# Altium project Line follower 3.PrjPcb
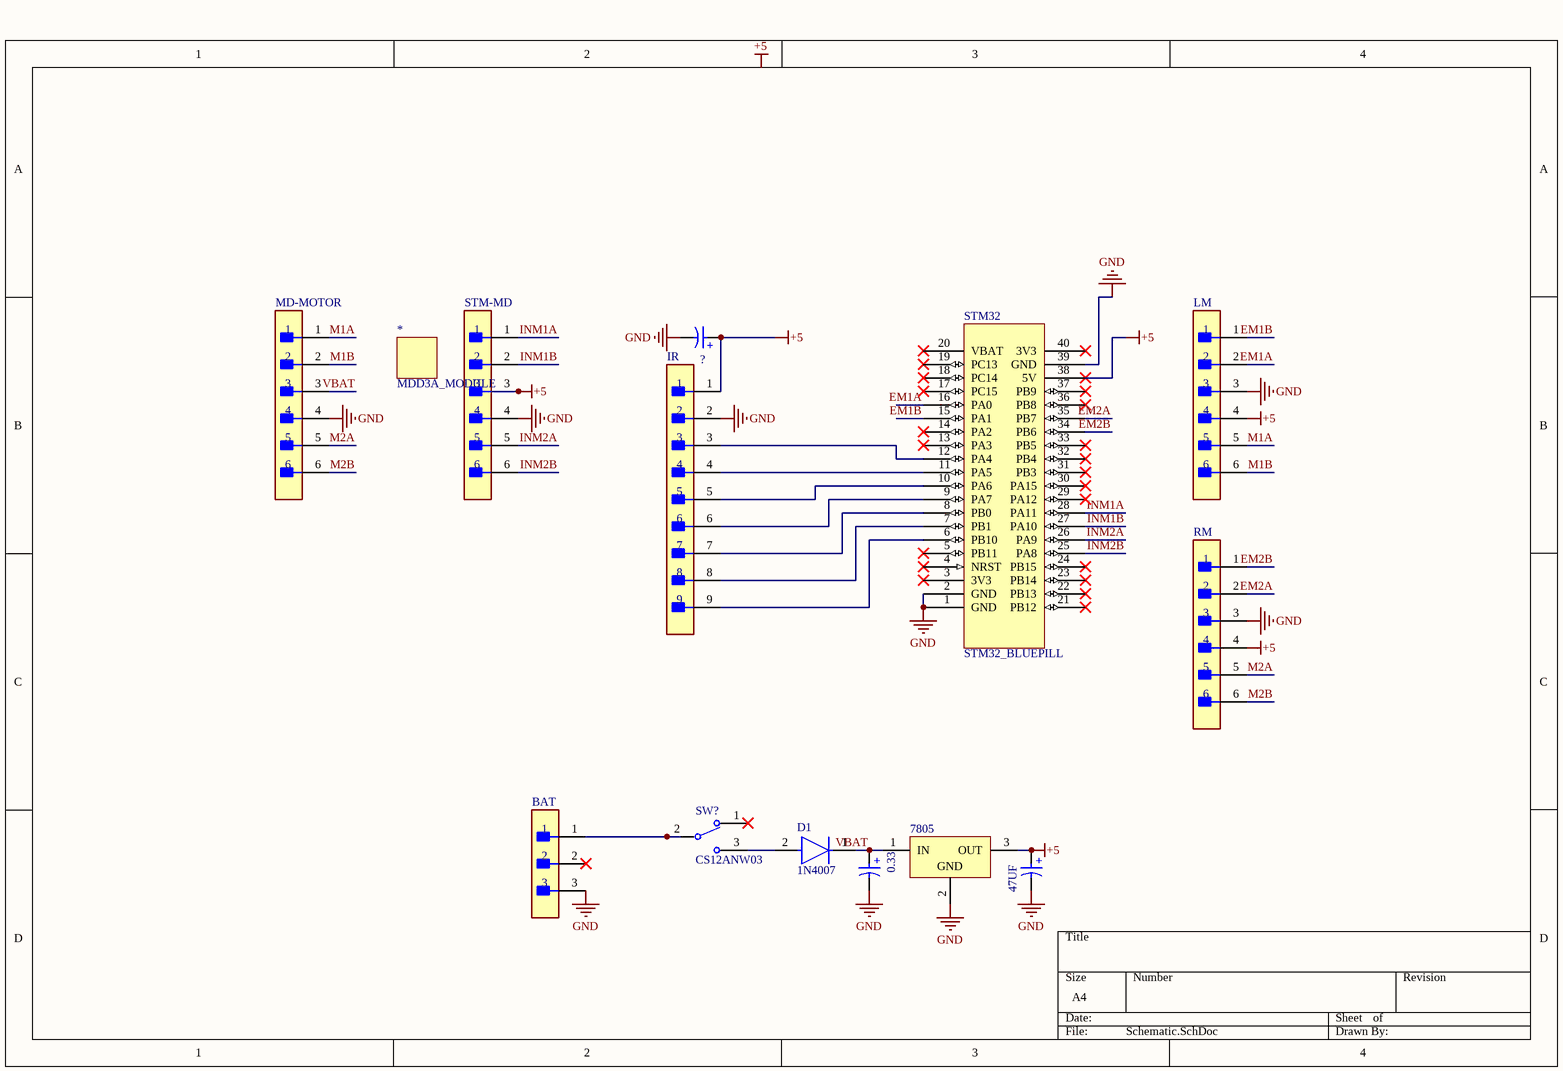
[diagram p0: Schematic.SchDoc]
1 sheet, 14 parts. Net scope: global (net labels, ports and power ports of the same name join across sheets).
Board file: PCB.PcbDoc

## Sheet Schematic.SchDoc
size A4; SheetNumber: 1; SheetTotal: 1

### Parts
0.33  860160274015  [WCAP-ATLL_D8H11.5]  (value not drawn)
47UF  860160274015  [WCAP-ATLL_D8H11.5]  (value not drawn)
7805  L7805CP  [TO220FP]  (value not drawn)
?  860160274015  [WCAP-ATLL_D8H11.5]  (value not drawn)
BAT  B03B-PASK-1(LF)(SN)  [FP-B03B-PASK-1_LF_SN-MFG]  (value not drawn)
D1  1N4007  [FP-1N4007-MFG]
IR  B09B-PASK-1(LF)(SN)  [FP-B09B-PASK-1_LF_SN-MFG]  (value not drawn)
LM  B06B-PASK(LF)(SN)  [FP-B06B-PASK_LF_SN-MFG]  (value not drawn)
MD-MOTOR  B06B-PASK(LF)(SN)  [FP-B06B-PASK_LF_SN-MFG]  (value not drawn)
MDD3A  MDD3A_MODULE  [MDD3A_MODULE]
RM  B06B-PASK(LF)(SN)  [FP-B06B-PASK_LF_SN-MFG]  (value not drawn)
STM32  STM32_BLUEPILL  [STM32_Bluepill]
STM-MD  B06B-PASK(LF)(SN)  [FP-B06B-PASK_LF_SN-MFG]  (value not drawn)
SW?  CS12ANW03  [FP-CS12ANW03-MFG]

### Nets
+5: 47UF.1(P) 7805.3(OUT) ?.1(P) IR.1 LM.4 RM.4 STM32.38(5V) STM-MD.3
GND: 0.33.2(N) 47UF.2(N) 7805.2(GND) ?.2(N) BAT.3 IR.2 LM.3 MD-MOTOR.4 RM.3 STM32.1(GND) STM32.2(GND) STM32.39(GND) STM-MD.4
EM1A: LM.2 STM32.16(PA0)
EM1B: LM.1 STM32.15(PA1)
EM2A: RM.2 STM32.35(PB7)
EM2B: RM.1 STM32.34(PB6)
INM1A: STM32.28(PA11) STM-MD.1
INM1B: STM32.27(PA10) STM-MD.2
INM2A: STM32.26(PA9) STM-MD.5
INM2B: STM32.25(PA8) STM-MD.6
M1A: LM.5 MD-MOTOR.1
M1B: LM.6 MD-MOTOR.2
M2A: MD-MOTOR.5 RM.5
M2B: MD-MOTOR.6 RM.6
VBAT: 0.33.1(P) 7805.1(IN) D1.1(C) MD-MOTOR.3
NetBAT_1: BAT.1 SW?.2(2(COM))
NetD1_2: D1.2(A) SW?.3
NetIR_3: IR.3 STM32.12(PA4)
NetIR_4: IR.4 STM32.11(PA5)
NetIR_5: IR.5 STM32.10(PA6)
NetIR_6: IR.6 STM32.9(PA7)
NetIR_7: IR.7 STM32.8(PB0)
NetIR_8: IR.8 STM32.7(PB1)
NetIR_9: IR.9 STM32.6(PB10)

Not connected (* = marked no-connect by the designer): BAT 2*; STM32 3(3V3)* 4(NRST)* 5(PB11)* 13(PA3)* 14(PA2)* 17(PC15)* 18(PC14)* 19(PC13)* 20(VBAT)* 21(PB12)* 22(PB13)* 23(PB14)* 24(PB15)* 29(PA12)* 30(PA15)* 31(PB3)* 32(PB4)* 33(PB5)* 36(PB8)* 37(PB9)* 40(3V3)*; SW? 1*

### Notes on the sheet
- Labels drawn without touching a wire or pin: +5
- (in symbol CMP-03913-54007388-2) +

### Library data of the parts
0.33 47UF ? = CMP-03913-54007388-2: Aluminium Electrolytic Capacitor-Leaded Rohs Compliant: Yes; Leakage Current: 27µA; Polarity: Polar; Voltage Rating: 10V; Ripple Current: 420mA; Pitch: 3.5mm; Impedance: 530mΩ; Life (Hours): 7000hours; Capacitance: 270µF; Tolerance: 20%; Mount: Through Hole; Max Operating Temperature: 105°C; Length: 11.5mm; Lead Pitch: 3.5052mm; Min Operating Temperature: -55°C; Height - Seated (Max): 13.0048mm; Case/Package: Radial; Diameter: 8mm; Packaging: Tape & Box (TB); RoHS: Compliant
7805 = CMP-0244-00474-1: Positive Voltage Regulator, 5V, 3-Pin TO-220FP; ComponentLink1Description: Manufacturer URL; ComponentLink2Description: Datasheet; DatasheetVersion: 16/11/2011; PackageDescription: TO, Thru-Hole, Vertical, Heatsink Mounted; 3 In-Line Leads; Pitch 2.54 mm; ComponentLink2URL: http://www.st.com/internet/com/TECHNICAL_RESOURCES/TECHNICAL_LITERATURE/DATASHEET/CD00000444.pdf; ComponentLink1URL: http://www.st.com; PackageVersion: 2011; PackageReference: TO220FP
BAT = CMP-17439-000193-1: CONN HEADER VERT 3POS 2MM; Voltage Rating: 250V; Current Rating: 3A; Mated Stacking Heights: 14.9mm; Number of Positions: 3; Packaging: Bulk; Contact Type: Male Pin; Flammability Rating: UL94 V-0; Contact Shape: Square; Number of Rows: 1; Color: Natural; Orientation: Straight; Housing Color: White; Fastening Type: Ramp; Insulation Material: PBT; Insulation Color: Natural; Mount: Through Hole; Contact Finish - Mating: TIN; Connector Type: Header; Termination: Solder; Contact Mating Length: 0.126inch; Lead Free: Lead Free; Contact Material: Copper Alloy; Pitch: 2mm; Series: PA; Number of Contacts: 3; Contact Plating: Tin
D1 = CMP-123542-000001-1: Rectifier diode 1000 V 1 A DO-41, ,; Manufacturer: Diotec; Max Surge Forward Current: 27A; Forward Current: 1A; Max Junction Temp: +175°C; Reverse Voltage: 1000V; Value: 15pF; Peak Reverse Current: 5uA; Category: Diode; Temperature Range Low: -50°C; Automotive: No; Temperature: -50°C to +175°C; Lead Free: Yes; ComponentLink2Description: Datasheet; Max Repetitive Reverse Voltage: 1000V; ComponentLink2URL: https://datasheet.octopart.com/1N4007-Diotec-datasheet-62346875.pdf; Manufacturer Part Number: 1N4007; Device Class L3: Rectifier Diodes; Height: 2.8mm; Octopart: https://octopart.com/1n4007-diotec-4040411; Package: 1N4007; Temperature Range High: +175°C; Device Class L1: Discrete Semiconductors; Device Class L2: Diodes; RoHS: TRUE; Capacitance: 15pF; Ipc Land Pattern Name: DIOAD888W100L520D280
IR = CMP-17439-000536-1: CONN HEADER VERT 9POS 2MM; Current Rating: 3A; Mated Stacking Heights: 14.9mm; Voltage Rating: 250V; Number of Positions: 9; Contact Mating Length: 0.126inch; Packaging: Bulk; Contact Material: Copper Alloy; Flammability Rating: UL94 V-0; Contact Type: Male Pin; Contact Finish - Mating: TIN; Fastening Type: Ramp; Color: Natural; Pitch: 2mm; Insulation Material: PBT; Contact Shape: Square; Number of Rows: 1; Orientation: Straight; Contact Plating: Tin; Mount: Through Hole; Lead Free: Lead Free; Number of Contacts: 9; Insulation Color: Natural; Housing Color: White; Connector Type: Header; Termination: Solder; Series: PA
LM MD-MOTOR RM STM-MD = CMP-17439-000140-1: CONN HEADER VERT 6POS 2MM; Pitch: 0.079inch; Number of Positions: 6; Connector Type: Male Pin; Contact Type: Male Pin; Color: Natural; Termination: Kinked Pin; Fastening Type: Ramp; Housing Color: White; Series: PA; Packaging: Bulk; Lead Free: Lead Free; Number of Contacts: 6; Mount: Through Hole; Contact Material: Copper Alloy; Number of Rows: 1; Contact Plating: Tin; Contact Mating Length: 0.126inch
SW? = CMP-31746-000002-1: SWITCH SLIDE SPDT 3A 125V; Max Voltage Rating (AC): 250V; Mechanical Life: 50000Cycles; Switch Travel: 2.2mm; Electrical Life: 20000Cycles; Actuator Length: 5.1mm; Illumination Type: Non-Illuminated; Contact Style: Non-Shorting; Actuator Type: Standard; Actuator Material: Nylon; Switch Function: On-On; Max Operating Temperature: 85°C; Series: CS; Contact Current Rating: 3A; Min Operating Temperature: -30°C; Current Rating: 3A; Mount: Through Hole; Depth: 7.5mm; RoHS Compliant: Yes; Throw Configuration: SPDT; Lead Free: Lead Free; Orientation: Vertical; Contact Plating: Silver; Reach SVHC Compliant: Yes; Termination: PC Pin; Max Current Rating: 3A; Packaging: Tray; Length: 14mm; Package Quantity: 1; Primary Type: SWITCH; Flammability Rating: UL94 V-0; Contact Material: Copper; Voltage Rating (AC): 125V